# EAGLE schematic ArmazCape - Rev B4 (EAGLE 7.7.0)
Assembly variants: ECO

## Sheet 1 of 4
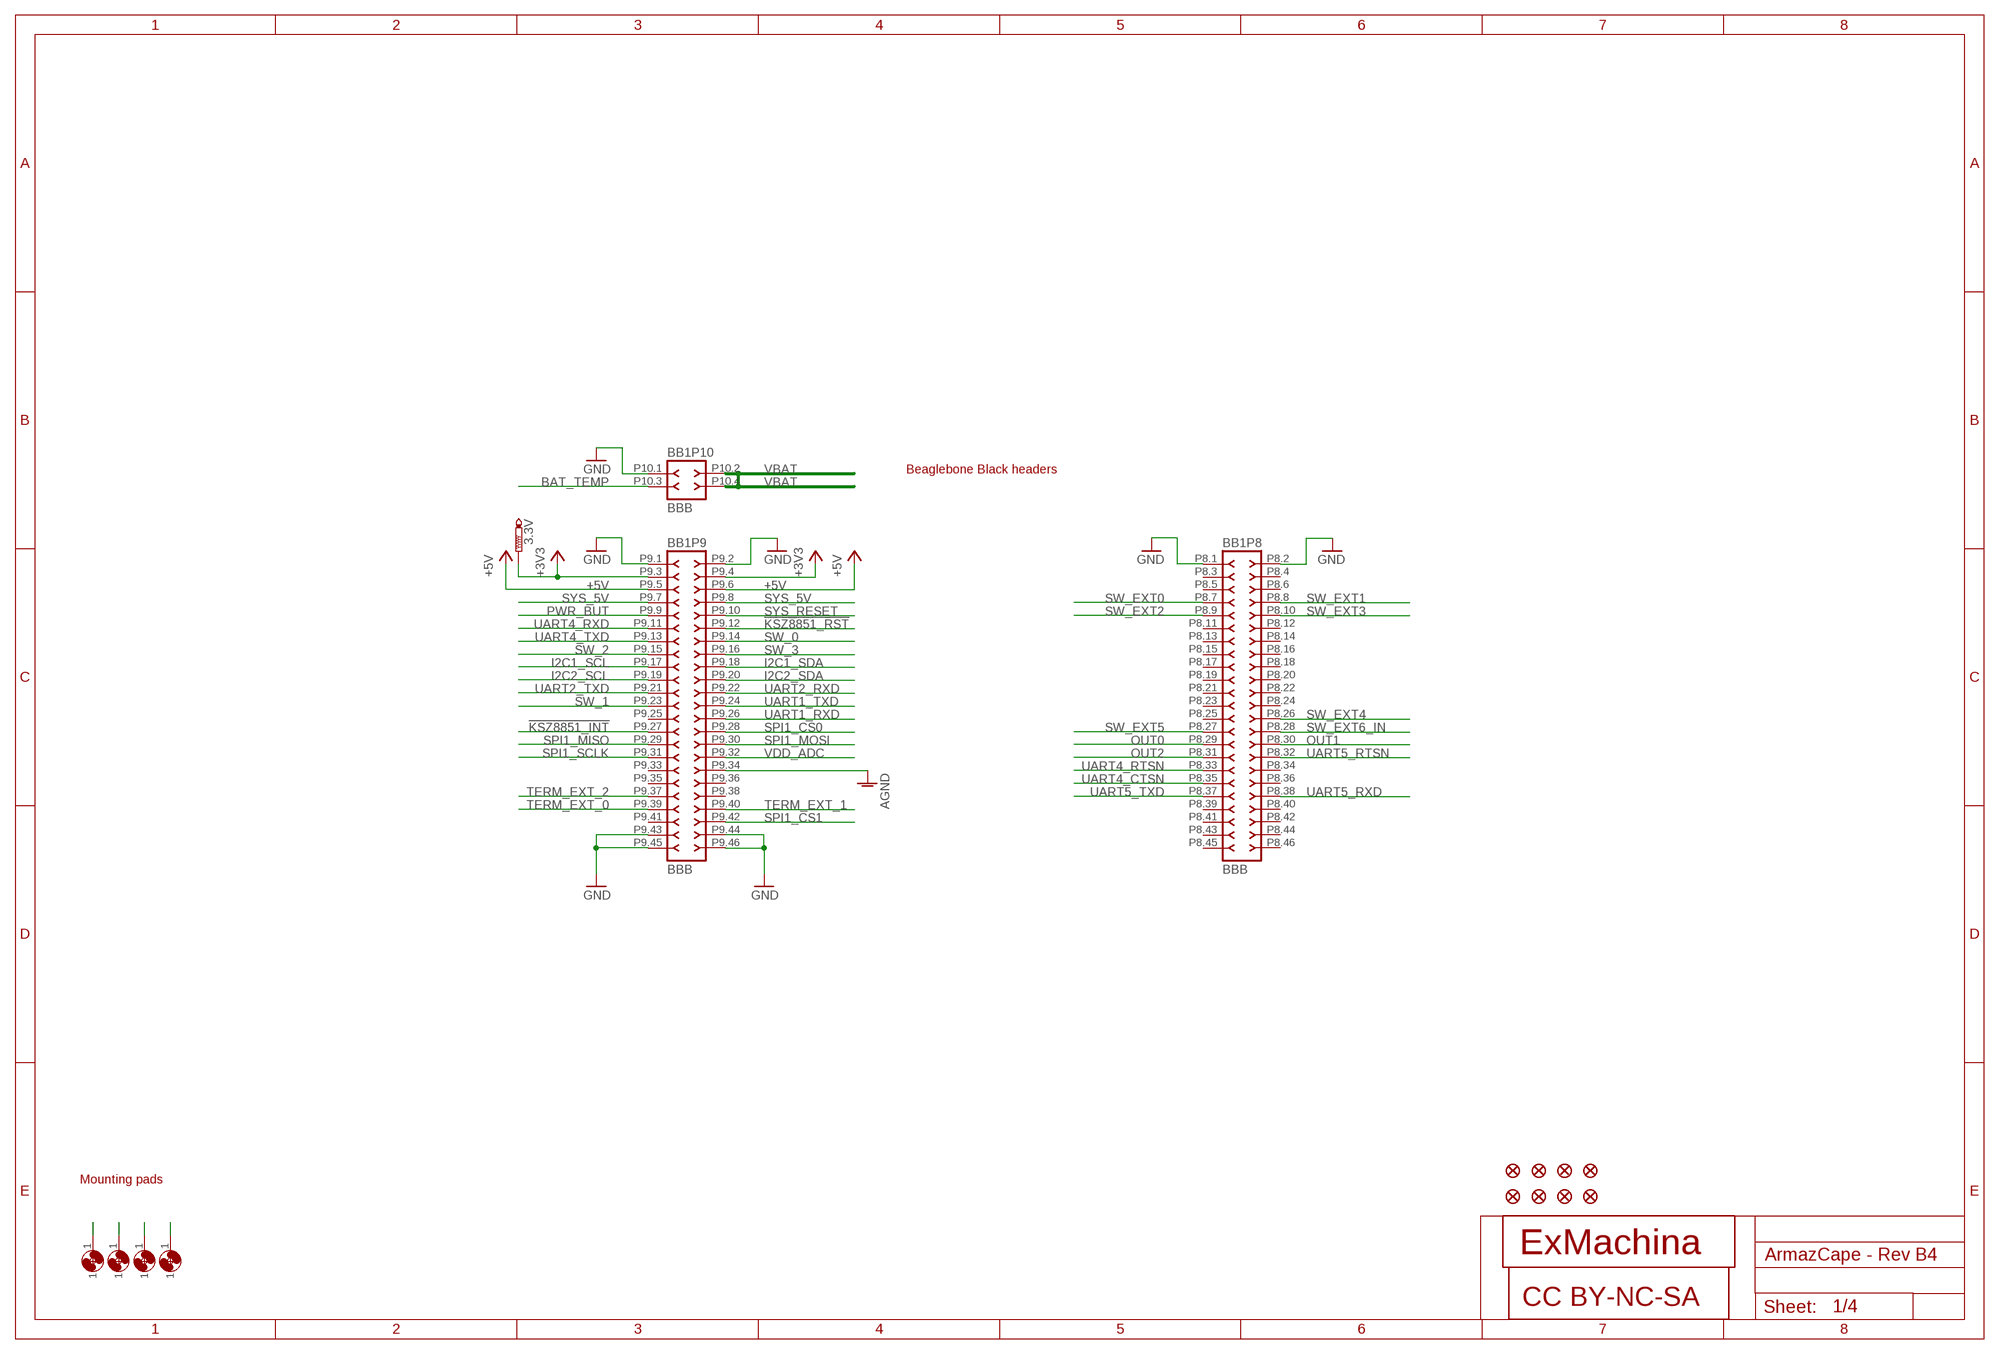
[diagram p0: schematic, sheet 1]

### Parts
3.3V  PTR1TP11R  [TP11R]
BB1  BBB  [BBB]
FI1  FIDUCIAL1X2  [FIDUCIAL-1X2]
FI2  FIDUCIAL1X2  [FIDUCIAL-1X2]
FI3  FIDUCIAL1X2  [FIDUCIAL-1X2]
FI4  FIDUCIAL1X2  [FIDUCIAL-1X2]
FI5  FIDUCIAL1X2  [FIDUCIAL-1X2]
FI6  FIDUCIAL1X2  [FIDUCIAL-1X2]
FI7  FIDUCIAL1X2  [FIDUCIAL-1X2]
FI8  FIDUCIAL1X2  [FIDUCIAL-1X2]
H1  MOUNT-PAD3,0  [P3,0]
H2  MOUNT-PAD3,0  [P3,0]
H3  MOUNT-PAD3,0  [P3,0]
H4  MOUNT-PAD3,0  [P3,0]
U$1  EXMACHINA-LOGO-NAME  [EXM-LOGO-BASELINE]
U$7  CC-BY-NC-SA  [CC-BY-NC-SA]

### Nets
!KSZ8851_INT: BB1.P9.27 ; also sheet 4
!KSZ8851_RST: BB1.P9.12 ; also sheet 4
+3V3 [supply]: 3.3V.TP BB1.P9.3 BB1.P9.4 ; also sheet 2,3,4
+5V [supply]: BB1.P9.5 BB1.P9.6 ; also sheet 2,3
AGND: BB1.P9.34
BAT_TEMP: BB1.P10.3 ; also sheet 3
GND [supply]: BB1.P8.1 BB1.P8.2 BB1.P9.1 BB1.P9.2 BB1.P9.43 BB1.P9.44 BB1.P9.45 BB1.P9.46 BB1.P10.1 ; also sheet 2,3,4
I2C1_SCL: BB1.P9.17
I2C1_SDA: BB1.P9.18
I2C2_SCL: BB1.P9.19 ; also sheet 2,3
I2C2_SDA: BB1.P9.20 ; also sheet 2,3
N$101 [supply]: H4.1
N$102 [supply]: H3.1
N$103 [supply]: H2.1
N$104 [supply]: H1.1
OUT0: BB1.P8.29 ; also sheet 3
OUT1: BB1.P8.30 ; also sheet 3
OUT2: BB1.P8.31 ; also sheet 3
PWR_BUT: BB1.P9.9
SPI1_CS0: BB1.P9.28 ; also sheet 4
SPI1_CS1: BB1.P9.42
SPI1_MISO: BB1.P9.29 ; also sheet 4
SPI1_MOSI: BB1.P9.30 ; also sheet 4
SPI1_SCLK: BB1.P9.31 ; also sheet 4
SW_0: BB1.P9.14 ; also sheet 3
SW_1: BB1.P9.23 ; also sheet 3
SW_2: BB1.P9.15 ; also sheet 3
SW_3: BB1.P9.16 ; also sheet 3
SW_EXT0: BB1.P8.7 ; also sheet 3
SW_EXT1: BB1.P8.8 ; also sheet 3
SW_EXT2: BB1.P8.9 ; also sheet 3
SW_EXT3: BB1.P8.10 ; also sheet 3
SW_EXT4: BB1.P8.26 ; also sheet 3
SW_EXT5: BB1.P8.27 ; also sheet 3
SW_EXT6_IN: BB1.P8.28 ; also sheet 3
SYS_5V [supply]: BB1.P9.7 BB1.P9.8 ; also sheet 3
SYS_RESET: BB1.P9.10
TERM_EXT_0: BB1.P9.39 ; also sheet 2
TERM_EXT_1: BB1.P9.40 ; also sheet 2
TERM_EXT_2: BB1.P9.37 ; also sheet 2
UART1_RXD: BB1.P9.26
UART1_TXD: BB1.P9.24
UART2_RXD: BB1.P9.22
UART2_TXD: BB1.P9.21
UART4_CTSN: BB1.P8.35
UART4_RTSN: BB1.P8.33
UART4_RXD: BB1.P9.11 ; also sheet 3
UART4_TXD: BB1.P9.13 ; also sheet 3
UART5_RTSN: BB1.P8.32
UART5_RXD: BB1.P8.38 ; also sheet 3
UART5_TXD: BB1.P8.37 ; also sheet 3
VBAT [supply]: BB1.P10.2 BB1.P10.4 ; also sheet 3
VDD_ADC: BB1.P9.32 ; also sheet 2
Unconnected: BB1.P8.3 BB1.P8.4 BB1.P8.5 BB1.P8.6 BB1.P8.11 BB1.P8.12 BB1.P8.13 BB1.P8.14 BB1.P8.15 BB1.P8.16 BB1.P8.17 BB1.P8.18 BB1.P8.19 BB1.P8.20 BB1.P8.21 BB1.P8.22 BB1.P8.23 BB1.P8.24 BB1.P8.25 BB1.P8.34 BB1.P8.36 BB1.P8.39 BB1.P8.40 BB1.P8.41 BB1.P8.42 BB1.P8.43 BB1.P8.44 BB1.P8.45 BB1.P8.46 BB1.P9.25 BB1.P9.33 BB1.P9.35 BB1.P9.36 BB1.P9.38 BB1.P9.41

### Notes on the sheet
- Beaglebone Black headers
- Mounting pads

## Sheet 2 of 4
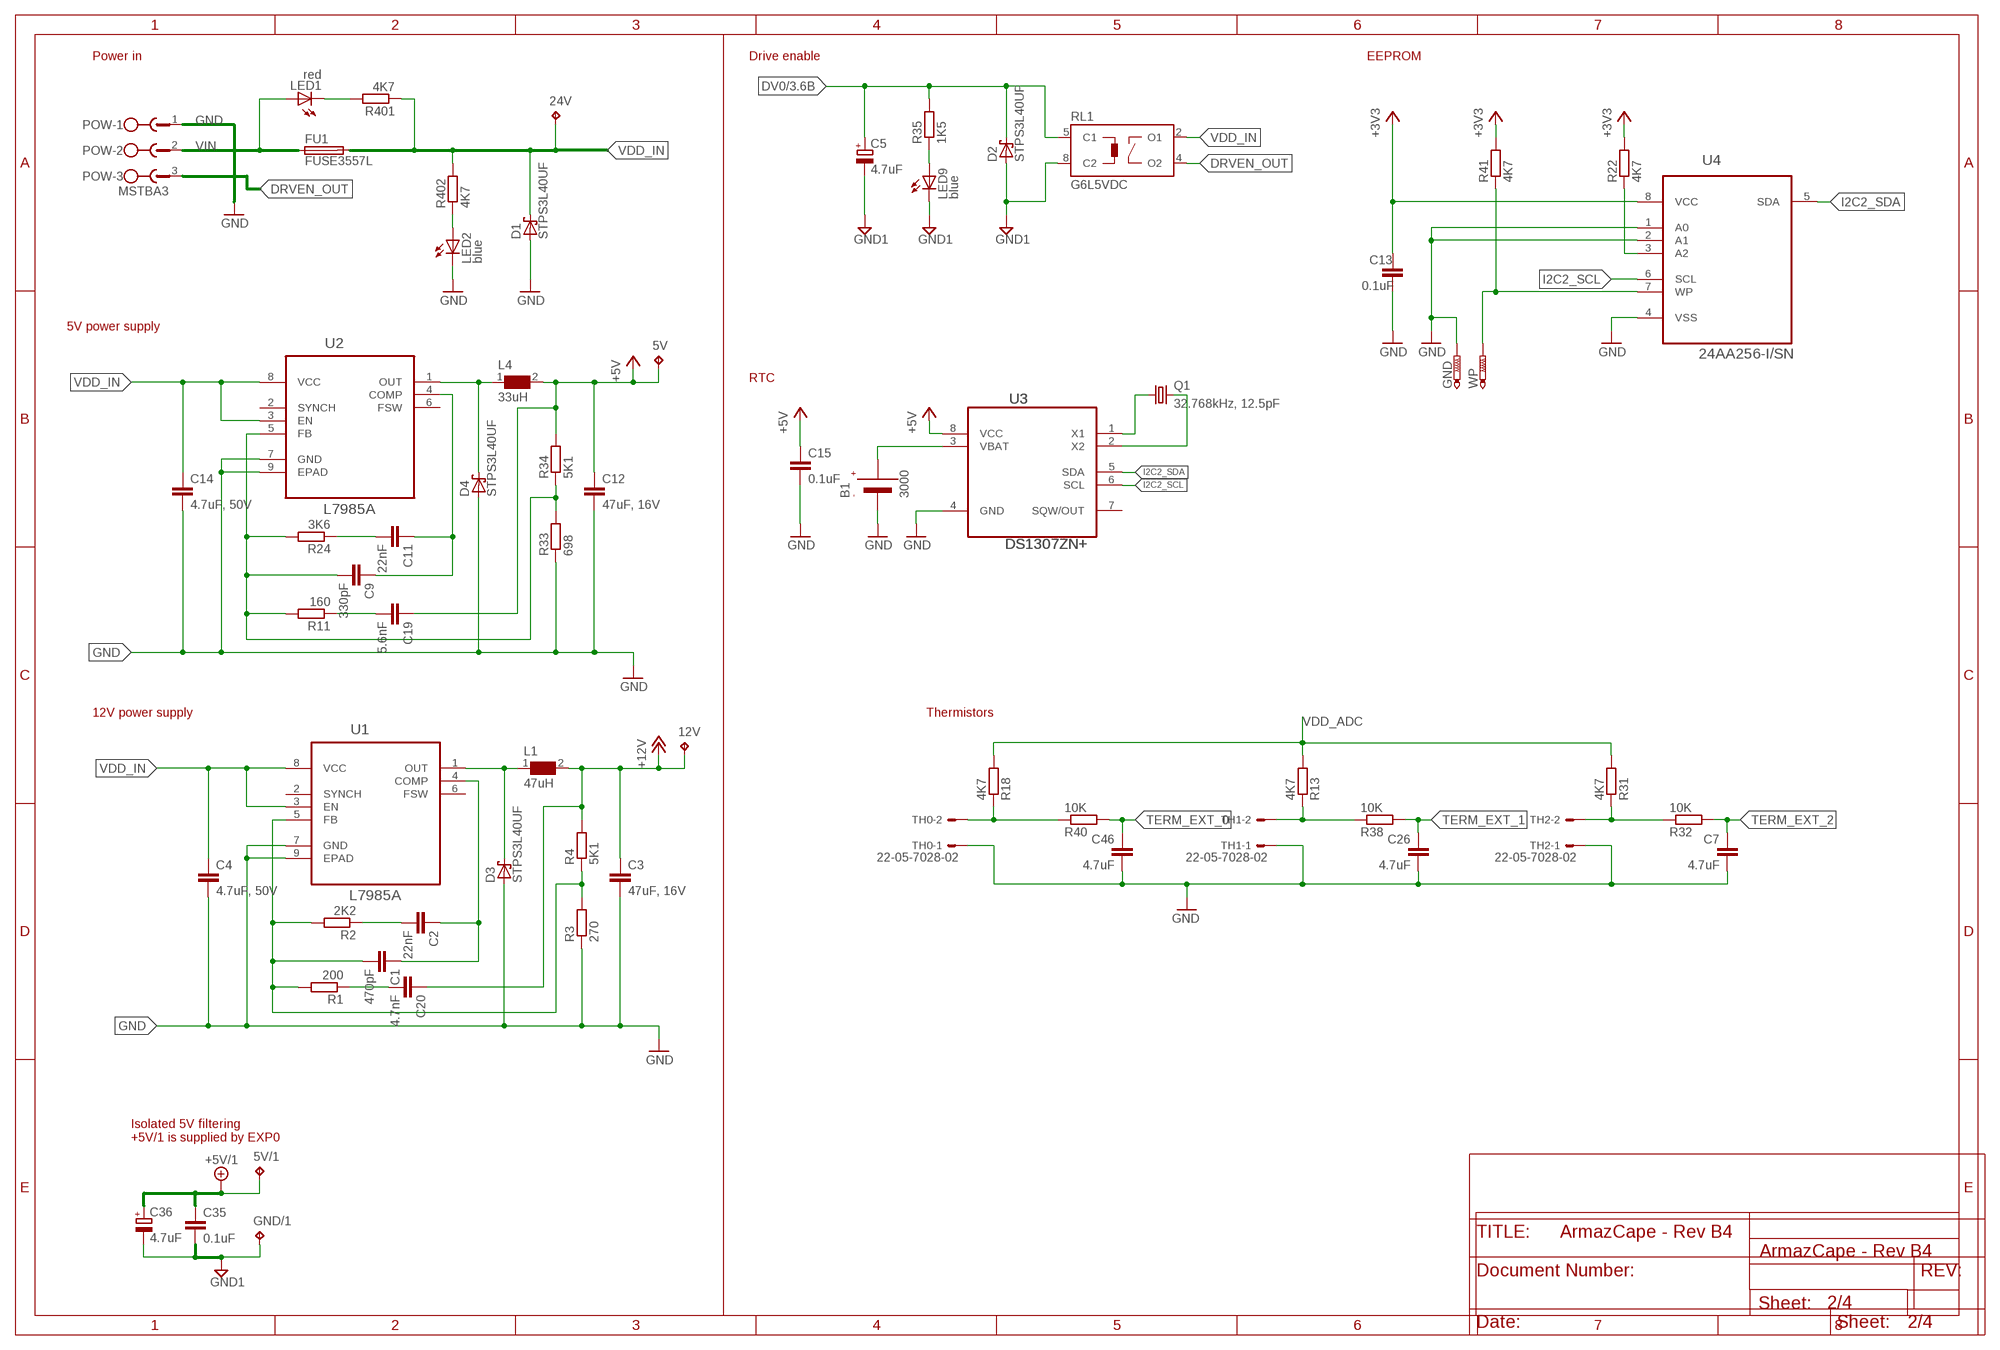
[diagram p1: schematic, sheet 2]

### Parts
5V  TPB1,27  [B1,27]
5V/1  TPB1,27  [B1,27]
12V  TPB1,27  [B1,27]
24V  TPB1,27  [B1,27]
B1  3000  [3000]
C1  470pF  C-EUC0603  [C0603]
C2  22nF  C-EUC0603  [C0603]
C3  47uF, 16V  C-EUC1210  [C1210]
C4  4.7uF, 50V  C-EUC1210  [C1210]
C5  4.7uF  CPOL-EUCT3216  [CT3216]
C7  4.7uF  C-EUC0603  [C0603]
C9  330pF  C-EUC0603  [C0603]
C11  22nF  C-EUC0603  [C0603]
C12  47uF, 16V  C-EUC1210  [C1210]
C13  0.1uF  C-EUC0603  [C0603]
C14  4.7uF, 50V  C-EUC1210  [C1210]
C15  0.1uF  C-EUC0603  [C0603]
C19  5.6nF  C-EUC0603  [C0603]
C20  4.7nF  C-EUC0603  [C0603]
C26  4.7uF  C-EUC0603  [C0603]
C35  0.1uF  C-EUC0603  [C0603]
C36  4.7uF  CPOL-EUCT3216  [CT3216]
C46  4.7uF  C-EUC0603  [C0603]
D1  STPS3L40UF  [SMB]
D2  STPS3L40UF  [SMB]
D3  STPS3L40UF  [SMB]
D4  STPS3L40UF  [SMB]
FU1  FUSE3557L  [3557-LITTLE]
GND  PTR1TP11SQ  [TP11SQ]
GND/1  TPB1,27  [B1,27]
L1  47uH  WE-PD-7447709470_1260/1245/1280/1210  [WE-PD_1260/1245/1280/1210]
L4  33uH  WE-PD-7447709330_1260/1245/1280/1210  [WE-PD_1260/1245/1280/1210]
LED1  red  LEDCHIP-LED0603  [CHIP-LED0603]
LED2  blue  LEDCHIP-LED0603  [CHIP-LED0603]
LED9  blue  LEDCHIP-LED0603  [CHIP-LED0603]  (not fitted in variant ECO)
POW  MSTBA3  [MSTBA3]
Q1  32.768kHz, 12.5pF  ABS07-32.768KHZ  [ABS07]
R1  200  R-EU_R0603  [R0603]
R2  2K2  R-EU_R0603  [R0603]
R3  270  R-EU_R0603  [R0603]
R4  5K1  R-EU_R0603  [R0603]
R11  160  R-EU_R0603  [R0603]
R13  4K7  R-EU_R0603  [R0603]
R18  4K7  R-EU_R0603  [R0603]
R22  4K7  R-EU_R0603  [R0603]
R24  3K6  R-EU_R0603  [R0603]
R31  4K7  R-EU_R0603  [R0603]
R32  10K  R-EU_R0603  [R0603]
R33  698  R-EU_R0603  [R0603]
R34  5K1  R-EU_R0603  [R0603]
R35  1K5  R-EU_R0603  [R0603]
R38  10K  R-EU_R0603  [R0603]
R40  10K  R-EU_R0603  [R0603]
R41  4K7  R-EU_R0603  [R0603]
R401  4K7  R-EU_R0603  [R0603]
R402  4K7  R-EU_R0603  [R0603]
RL1  G6L5VDC  [G6L-1F]
TH0  22-05-7028-02  [7395-02]
TH1  22-05-7028-02  [7395-02]
TH2  22-05-7028-02  [7395-02]
U1  L7985A  [SOIC127P600X170-9N]
U2  L7985A  [SOIC127P600X170-9N]
U3  DS1307ZN+  MAXIM_DS1307ZN+  [MAXIM_SOIC127P600X175-8N]
U4  24AA256-I/SN  MICROCHIP_BY_ELEMENT14_BATCH_1_24AA256-I/SN  [MICROCHIP_BY_ELEMENT14_BATCH_1_SOIC127P600X175-8N]
WP  PTR1TP11R  [TP11R]

### Nets
+3V3 [supply]: C13.1 R22.2 R41.2 U4.8(VCC) ; also sheet 1,3,4
+5V [supply]: 5V.TP C12.1 C15.1 C19.1 L4.2 R34.2 U3.8(VCC) ; also sheet 1,3
+5V/1 [supply]: 5V/1.TP C35.1 C36.+ ; also sheet 3
+12V [supply]: 12V.TP C3.1 C20.1 L1.2 R4.2 ; also sheet 3
DRVEN_OUT [supply]: POW.3 RL1.4(O2)
DV0: C5.+ D2.C R35.2 RL1.5(C1) ; also sheet 3
GND [supply]: B1.-(VBAT-) C3.2 C4.2 C7.2 C12.2 C13.2 C14.2 C15.2 C26.2 C46.2 D1.A D3.A D4.A GND.TP LED2.C POW.1 R3.1 R33.1 TH0.1 TH1.1 TH2.1 U1.7(GND) U1.9(EPAD) U2.7(GND) U2.9(EPAD) U3.4(GND) U4.1(A0) U4.2(A1) U4.4(VSS) ; also sheet 1,3,4
GND1 [supply]: C5.- C35.2 C36.- D2.A GND/1.TP LED9.C RL1.8(C2) ; also sheet 3
I2C2_SCL: U3.6(SCL) U4.6(SCL) ; also sheet 1,3
I2C2_SDA: U3.5(SDA) U4.5(SDA) ; also sheet 1,3
N$1 [supply]: C1.2 R1.2 R2.2 R3.2 R4.1 U1.5(FB)
N$2: C2.2 R2.1
N$3: C1.1 C2.1 U1.4(COMP)
N$7: LED9.A R35.1
N$8: LED1.C R401.2
N$19 [supply]: D4.C L4.1 U2.1(OUT)
N$21 [supply]: C9.2 R11.2 R24.2 R33.2 R34.1 U2.5(FB)
N$24: Q1.1 U3.1(X1)
N$25: R31.1 R32.1 TH2.2
N$26: Q1.2 U3.2(X2)
N$28: C11.2 R24.1
N$29: C9.1 C11.1 U2.4(COMP)
N$30 [supply]: D3.C L1.1 U1.1(OUT)
N$32: C19.2 R11.1
N$33: C20.2 R1.1
N$34: R41.1 U4.7(WP) WP.TP
N$35: R22.1 U4.3(A2)
N$96: LED2.A R402.1
N$237: R13.1 R38.1 TH1.2
N$240: R18.1 R40.1 TH0.2
TERM_EXT_0: C46.1 R40.2 ; also sheet 1
TERM_EXT_1: C26.1 R38.2 ; also sheet 1
TERM_EXT_2: C7.1 R32.2 ; also sheet 1
VBAT+ [supply]: B1.+1(VBAT+) B1.+2(VBAT+) U3.3(VBAT)
VDD_ADC: R13.2 R18.2 R31.2 ; also sheet 1
VDD_IN [supply]: 24V.TP C4.1 C14.1 D1.C FU1.3 FU1.4 R401.1 R402.2 RL1.2(O1) U1.3(EN) U1.8(VCC) U2.3(EN) U2.8(VCC)
VIN [supply]: FU1.1 FU1.2 LED1.A POW.2
Unconnected: U1.2(SYNCH) U1.6(FSW) U2.2(SYNCH) U2.6(FSW) U3.7(SQW/OUT)

### Notes on the sheet
- Power in | Drive enable | EEPROM
- 5V power supply
- RTC
- 12V power supply | Thermistors
- Isolated 5V filtering
  +5V/1 is supplied by EXP0

## Sheet 3 of 4
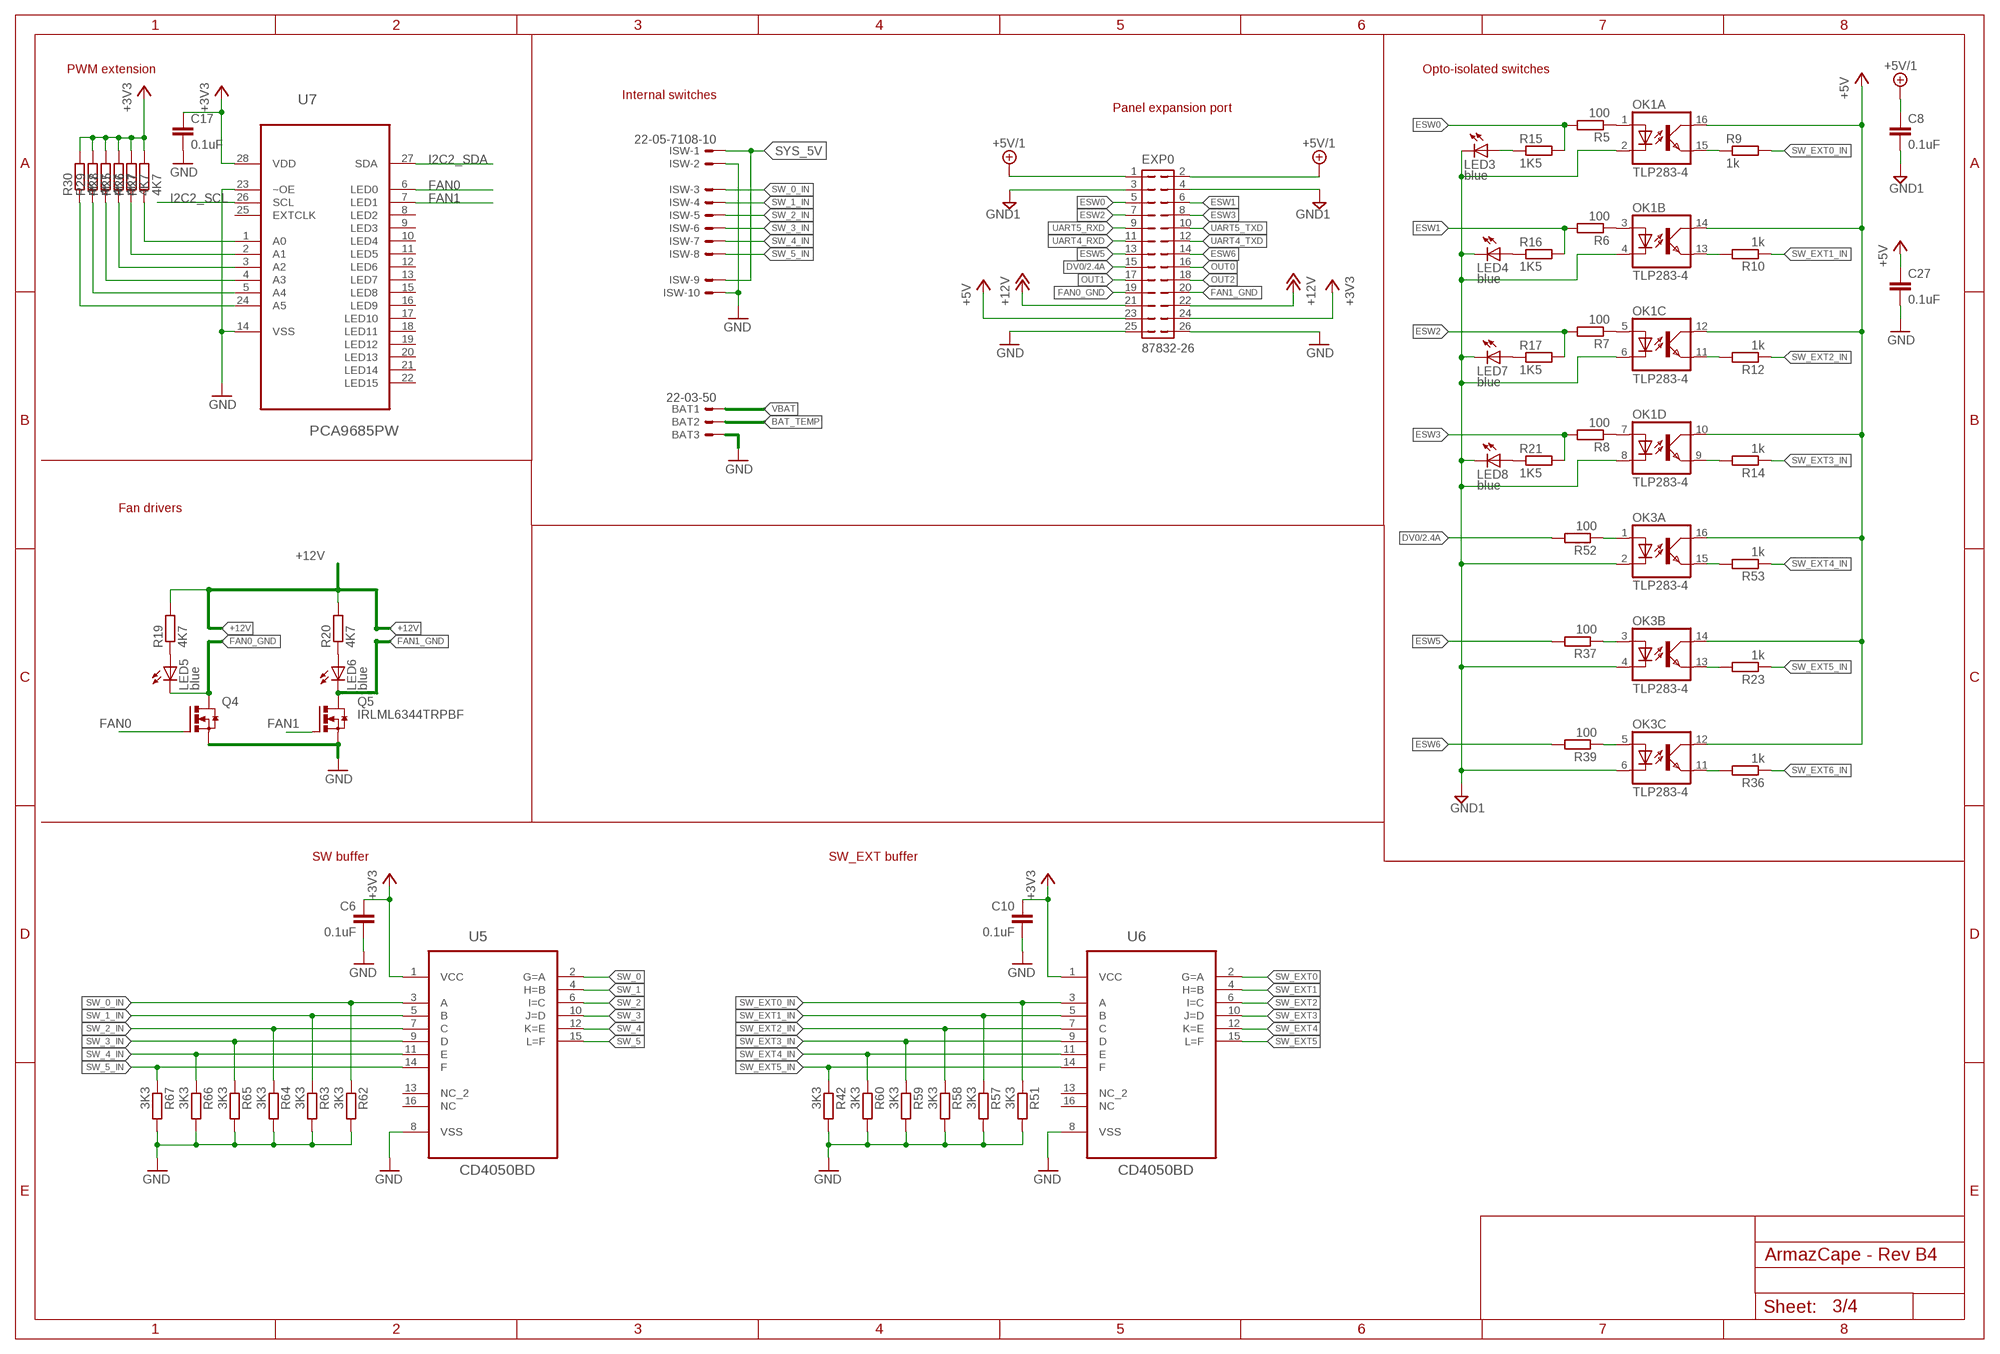
[diagram p2: schematic, sheet 3]

### Parts
BAT  22-03-50  [5267-03A]
C6  0.1uF  C-EUC0603  [C0603]
C8  0.1uF  C-EUC0603  [C0603]
C10  0.1uF  C-EUC0603  [C0603]
C17  0.1uF  C-EUC0603  [C0603]
C27  0.1uF  C-EUC0603  [C0603]
EXP0  87832-26  [87832-26]
ISW  22-05-7108-10  [7395-10]
LED3  blue  LEDCHIP-LED0603  [CHIP-LED0603]  (not fitted in variant ECO)
LED4  blue  LEDCHIP-LED0603  [CHIP-LED0603]  (not fitted in variant ECO)
LED5  blue  LEDCHIP-LED0603  [CHIP-LED0603]  (not fitted in variant ECO)
LED6  blue  LEDCHIP-LED0603  [CHIP-LED0603]  (not fitted in variant ECO)
LED7  blue  LEDCHIP-LED0603  [CHIP-LED0603]  (not fitted in variant ECO)
LED8  blue  LEDCHIP-LED0603  [CHIP-LED0603]  (not fitted in variant ECO)
OK1  TLP283-4  [MINI-FLAT-16]
OK3  TLP283-4  [MINI-FLAT-16]
Q4  IRLML6344TRPBF  [SOT95P240X112-3N]
Q5  IRLML6344TRPBF  [SOT95P240X112-3N]
R5  100  R-EU_R0603  [R0603]
R6  100  R-EU_R0603  [R0603]
R7  100  R-EU_R0603  [R0603]
R8  100  R-EU_R0603  [R0603]
R9  1k  R-EUR0603  [R0603]
R10  1k  R-EUR0603  [R0603]
R12  1k  R-EUR0603  [R0603]
R14  1k  R-EUR0603  [R0603]
R15  1K5  R-EU_R0603  [R0603]
R16  1K5  R-EU_R0603  [R0603]
R17  1K5  R-EU_R0603  [R0603]
R19  4K7  R-EU_R0603  [R0603]
R20  4K7  R-EU_R0603  [R0603]
R21  1K5  R-EU_R0603  [R0603]
R23  1k  R-EUR0603  [R0603]
R25  4K7  R-EU_R0603  [R0603]
R26  4K7  R-EU_R0603  [R0603]
R27  4K7  R-EU_R0603  [R0603]
R28  4K7  R-EU_R0603  [R0603]
R29  4K7  R-EU_R0603  [R0603]
R30  4K7  R-EU_R0603  [R0603]
R36  1k  R-EUR0603  [R0603]
R37  100  R-EU_R0603  [R0603]
R39  100  R-EU_R0603  [R0603]
R42  3K3  R-EU_R0603  [R0603]
R51  3K3  R-EU_R0603  [R0603]
R52  100  R-EU_R0603  [R0603]
R53  1k  R-EUR0603  [R0603]
R57  3K3  R-EU_R0603  [R0603]
R58  3K3  R-EU_R0603  [R0603]
R59  3K3  R-EU_R0603  [R0603]
R60  3K3  R-EU_R0603  [R0603]
R62  3K3  R-EU_R0603  [R0603]
R63  3K3  R-EU_R0603  [R0603]
R64  3K3  R-EU_R0603  [R0603]
R65  3K3  R-EU_R0603  [R0603]
R66  3K3  R-EU_R0603  [R0603]
R67  3K3  R-EU_R0603  [R0603]
U5  CD4050BD  [SOIC127P600X175-16N]
U6  CD4050BD  [SOIC127P600X175-16N]
U7  PCA9685PW  [SOP65P640X110-28N]

### Nets
+3V3 [supply]: C6.1 C10.1 C17.1 EXP0.24 R25.2 R26.2 R27.2 R28.2 R29.2 R30.2 U5.1(VCC) U6.1(VCC) U7.28(VDD) ; also sheet 1,2,4
+5V [supply]: C27.1 EXP0.23 OK1.10(D:COL) OK1.12(C:COL) OK1.14(B:COL) OK1.16(A:COL) OK3.12(C:COL) OK3.14(B:COL) OK3.16(A:COL) ; also sheet 1,2
+5V/1 [supply]: C8.1 EXP0.1 EXP0.2 ; also sheet 2
+12V [supply]: EXP0.21 EXP0.22 R19.2 R20.2 ; also sheet 2
BAT_TEMP: BAT.P2 ; also sheet 1
DV0: EXP0.15 R52.2 ; also sheet 2
ESW0: EXP0.5 R5.2 R15.2
ESW1: EXP0.6 R6.2 R16.2
ESW2: EXP0.7 R7.2 R17.2
ESW3: EXP0.8 R8.2 R21.2
ESW5: EXP0.13 R37.2
ESW6: EXP0.14 R39.2
FAN0: Q4.1(G) U7.6(LED0)
FAN0_GND [supply]: EXP0.19 LED5.C Q4.3(D)
FAN1: Q5.1(G) U7.7(LED1)
FAN1_GND [supply]: EXP0.20 LED6.C Q5.3(D)
GND [supply]: BAT.P3 C6.2 C10.2 C17.2 C27.2 EXP0.25 EXP0.26 ISW.2 ISW.10 Q4.2(S) Q5.2(S) R42.2 R51.2 R57.2 R58.2 R59.2 R60.2 R62.2 R63.2 R64.2 R65.2 R66.2 R67.2 U5.8(VSS) U6.8(VSS) U7.14(VSS) U7.23(~OE) ; also sheet 1,2,4
GND1 [supply]: C8.2 EXP0.3 EXP0.4 LED3.C LED4.C LED7.C LED8.C OK1.2(A:C) OK1.4(B:C) OK1.6(C:C) OK1.8(D:C) OK3.2(A:C) OK3.4(B:C) OK3.6(C:C) ; also sheet 2
I2C2_SCL: U7.26(SCL) ; also sheet 1,2
I2C2_SDA: U7.27(SDA) ; also sheet 1,2
N$4: OK3.11(C:EMIT) R36.2
N$5: OK3.13(B:EMIT) R23.2
N$6: OK3.3(B:A) R37.1
N$9: LED5.A R19.1
N$10: OK1.1(A:A) R5.1
N$11: OK1.15(A:EMIT) R9.1
N$12: OK1.7(D:A) R8.1
N$13: OK1.9(D:EMIT) R14.2
N$14: OK1.11(C:EMIT) R12.2
N$15: OK1.13(B:EMIT) R10.2
N$16: LED3.A R15.1
N$17: OK1.3(B:A) R6.1
N$18: LED4.A R16.1
N$20: LED7.A R17.1
N$22: LED8.A R21.1
N$23: OK1.5(C:A) R7.1
N$27: OK3.5(C:A) R39.1
N$53: OK3.1(A:A) R52.1
N$54: OK3.15(A:EMIT) R53.2
N$58: R27.1 U7.1(A0)
N$59: R26.1 U7.2(A1)
N$76: R25.1 U7.3(A2)
N$94: R28.1 U7.4(A3)
N$95: R29.1 U7.5(A4)
N$112: R30.1 U7.24(A5)
N$117: LED6.A R20.1
OUT0: EXP0.16 ; also sheet 1
OUT1: EXP0.17 ; also sheet 1
OUT2: EXP0.18 ; also sheet 1
SW_0: U5.2(G=A) ; also sheet 1
SW_0_IN: ISW.3 R62.1 U5.3(A)
SW_1: U5.4(H=B) ; also sheet 1
SW_1_IN: ISW.4 R63.1 U5.5(B)
SW_2: U5.6(I=C) ; also sheet 1
SW_2_IN: ISW.5 R64.1 U5.7(C)
SW_3: U5.10(J=D) ; also sheet 1
SW_3_IN: ISW.6 R65.1 U5.9(D)
SW_4: U5.12(K=E)
SW_4_IN: ISW.7 R66.1 U5.11(E)
SW_5: U5.15(L=F)
SW_5_IN: ISW.8 R67.1 U5.14(F)
SW_EXT0: U6.2(G=A) ; also sheet 1
SW_EXT0_IN: R9.2 R51.1 U6.3(A)
SW_EXT1: U6.4(H=B) ; also sheet 1
SW_EXT1_IN: R10.1 R57.1 U6.5(B)
SW_EXT2: U6.6(I=C) ; also sheet 1
SW_EXT2_IN: R12.1 R58.1 U6.7(C)
SW_EXT3: U6.10(J=D) ; also sheet 1
SW_EXT3_IN: R14.1 R59.1 U6.9(D)
SW_EXT4: U6.12(K=E) ; also sheet 1
SW_EXT4_IN: R53.1 R60.1 U6.11(E)
SW_EXT5: U6.15(L=F) ; also sheet 1
SW_EXT5_IN: R23.1 R42.1 U6.14(F)
SW_EXT6_IN: R36.1 ; also sheet 1
SYS_5V [supply]: ISW.1 ISW.9 ; also sheet 1
UART4_RXD: EXP0.11 ; also sheet 1
UART4_TXD: EXP0.12 ; also sheet 1
UART5_RXD: EXP0.9 ; also sheet 1
UART5_TXD: EXP0.10 ; also sheet 1
VBAT [supply]: BAT.P1 ; also sheet 1
Unconnected: OK3.7(D:A) OK3.8(D:C) OK3.9(D:EMIT) OK3.10(D:COL) U5.13(NC_2) U5.16(NC) U6.13(NC_2) U6.16(NC) U7.8(LED2) U7.9(LED3) U7.10(LED4) U7.11(LED5) U7.12(LED6) U7.13(LED7) U7.15(LED8) U7.16(LED9) U7.17(LED10) U7.18(LED11) U7.19(LED12) U7.20(LED13) U7.21(LED14) U7.22(LED15) U7.25(EXTCLK)

### Notes on the sheet
- PWM extension | Opto-isolated switches
- Internal switches
- Panel expansion port
- Fan drivers
- SW buffer | SW_EXT buffer

## Sheet 4 of 4
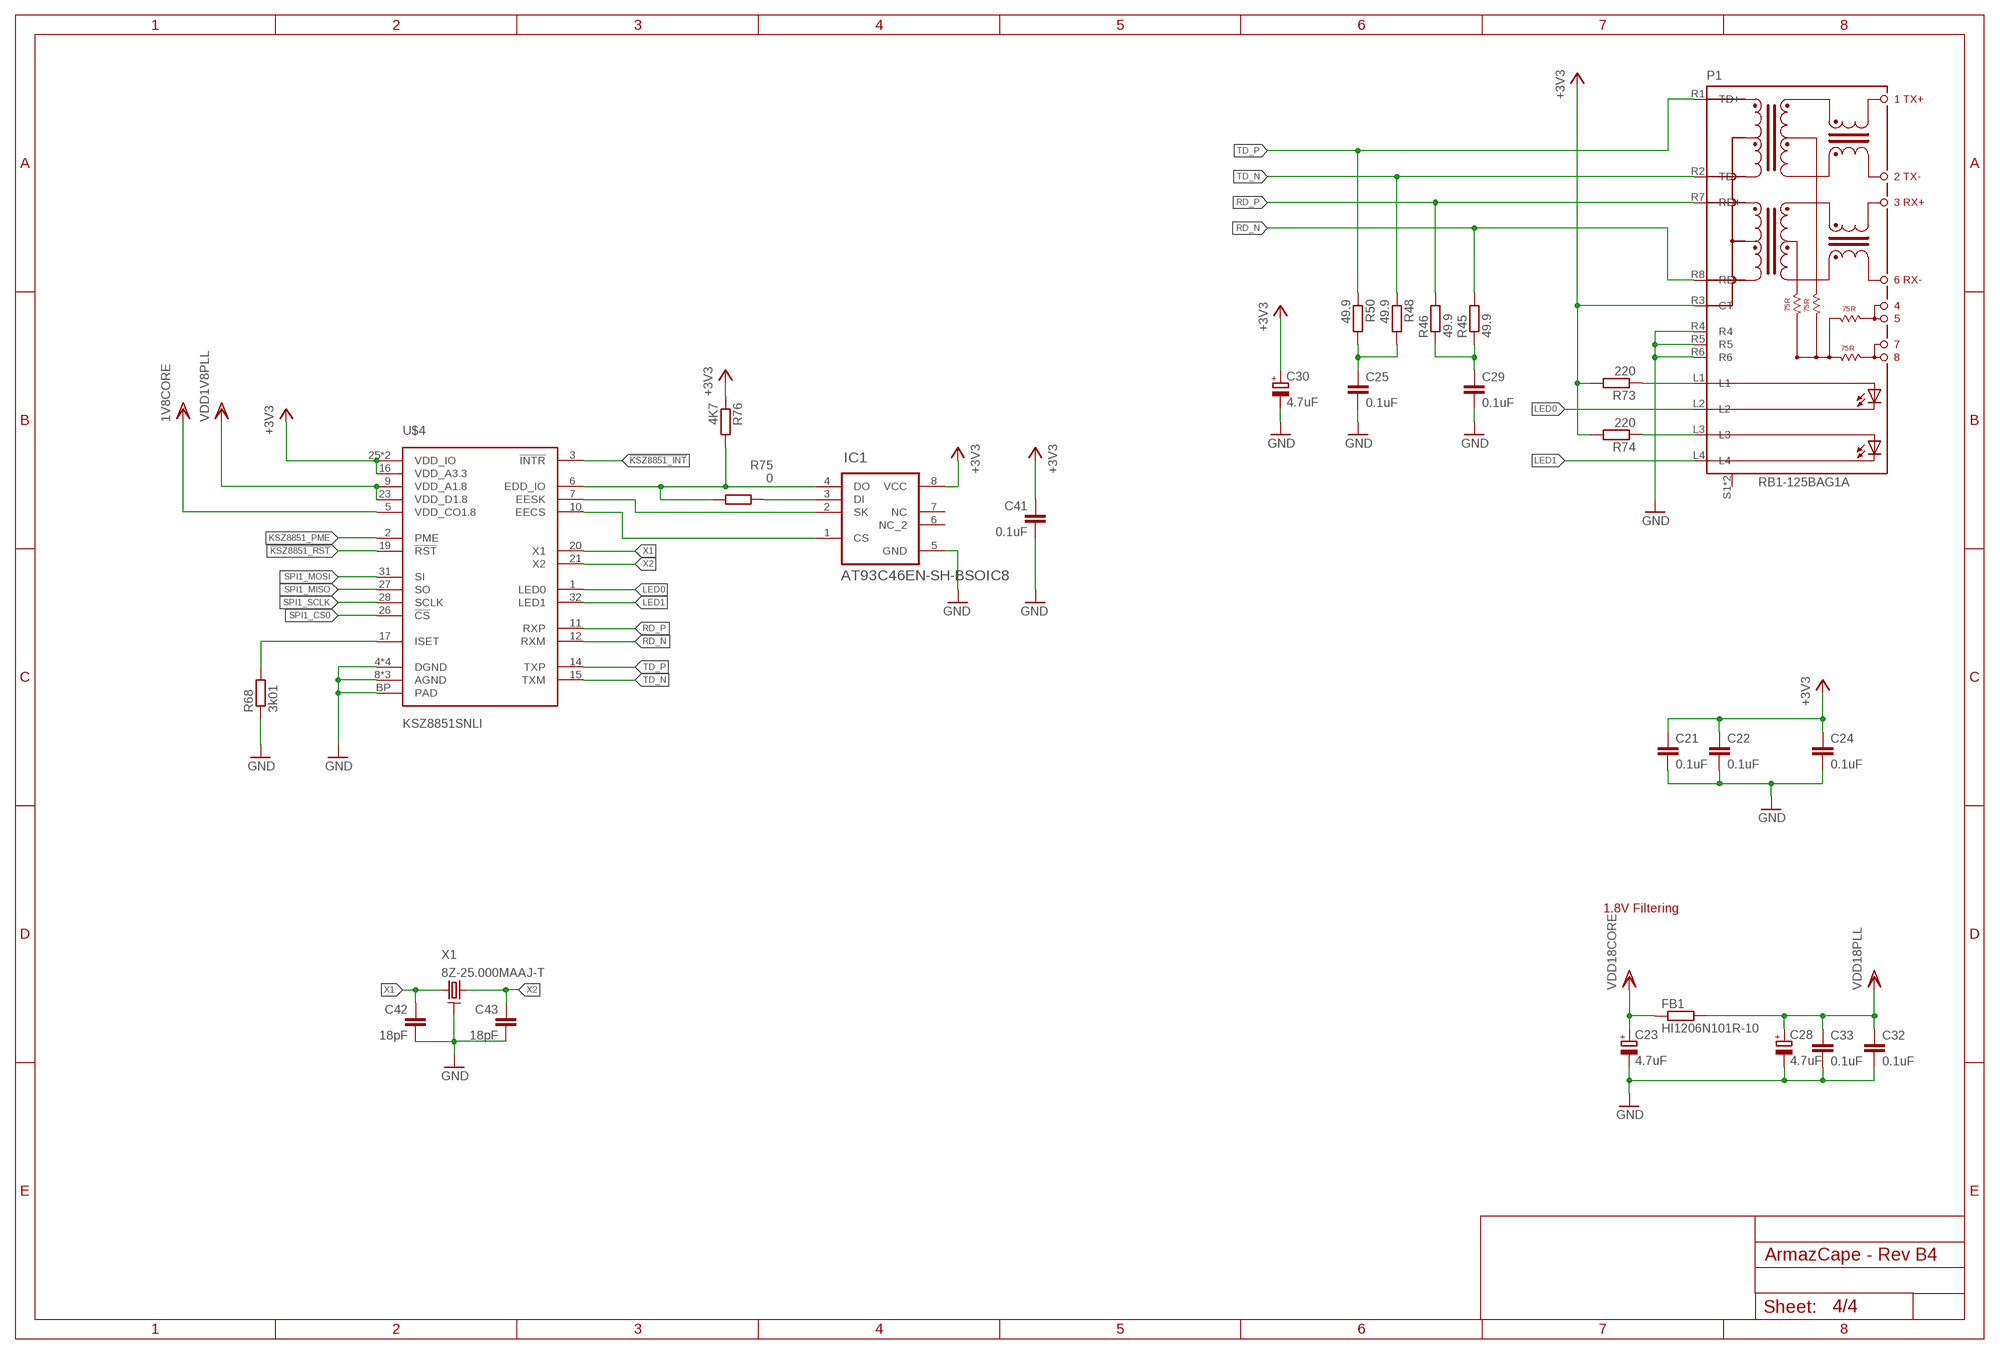
[diagram p3: schematic, sheet 4]

### Parts
C21  0.1uF  C-EUC0603  [C0603]
C22  0.1uF  C-EUC0603  [C0603]
C23  4.7uF  CPOL-EUCT3216  [CT3216]
C24  0.1uF  C-EUC0603  [C0603]
C25  0.1uF  C-EUC0603  [C0603]
C28  4.7uF  CPOL-EUCT3216  [CT3216]
C29  0.1uF  C-EUC0603  [C0603]
C30  4.7uF  CPOL-EUCT3216  [CT3216]
C32  0.1uF  C-EUC0603  [C0603]
C33  0.1uF  C-EUC0603  [C0603]
C41  0.1uF  C-EUC0603  [C0603]
C42  18pF  C-EUC0603  [C0603]
C43  18pF  C-EUC0603  [C0603]
FB1  HI1206N101R-10  [1206]
IC1  AT93C46EN-SH-BSOIC8  [SOIC8]
P1  RB1-125BAG1A  [WIZNET_RB1-125BAG1A]
R45  49.9  R-EU_R0603  [R0603]
R46  49.9  R-EU_R0603  [R0603]
R48  49.9  R-EU_R0603  [R0603]
R50  49.9  R-EU_R0603  [R0603]
R68  3k01  R-EU_R0603  [R0603]
R73  220  R-EU_R0603  [R0603]
R74  220  R-EU_R0603  [R0603]
R75  0  R-EU_R0603  [R0603]
R76  4K7  R-EU_R0603  [R0603]
U$4  KSZ8851SNLI  [QFN50P500X500X85-32L]
X1  8Z-25.000MAAJ-T  8Z-25.000MHZMAAJ-T  [SMD2.5X2]

### Nets
!KSZ8851_INT: U$4.3(!INTR) ; also sheet 1
!KSZ8851_RST: U$4.19(!RST) ; also sheet 1
+3V3 [supply]: C21.1 C22.1 C24.1 C30.+ C41.1 IC1.8(VCC) P1.R3(CT) R73.2 R74.2 R76.1 U$4.16(VDD_A3.3) U$4.25(VDD_IO) U$4.30(VDD_IO) ; also sheet 1,2,3
EDDIO: IC1.4(DO) R75.2 R76.2 U$4.6(EDD_IO)
EECS: IC1.1(CS) U$4.10(EECS)
EESK: IC1.2(SK) U$4.7(EESK)
GND [supply]: C21.2 C22.2 C23.- C24.2 C25.2 C28.- C29.2 C30.- C32.2 C33.2 C41.2 C42.2 C43.2 IC1.5(GND) P1.R4 P1.R5 P1.R6 R68.1 U$4.4(DGND) U$4.8(AGND) U$4.13(AGND) U$4.18(AGND) U$4.22(DGND) U$4.24(DGND) U$4.29(DGND) U$4.BP(PAD) X1.2 X1.4 ; also sheet 1,2,3
KSZ8851_PME: U$4.2(PME)
LED0: P1.L2 U$4.1(LED0)
LED1: P1.L4 U$4.32(LED1)
N$43: C25.1 R48.2 R50.2
N$49: C29.1 R45.1 R46.1
N$50: R68.2 U$4.17(ISET)
N$56: P1.L1 R73.1
N$60: P1.L3 R74.1
N$64: IC1.3(DI) R75.1
RD_N: P1.R8(RD-) R45.2 U$4.12(RXM)
RD_P: P1.R7(RD+) R46.2 U$4.11(RXP)
SPI1_CS0: U$4.26(!CS) ; also sheet 1
SPI1_MISO: U$4.27(SO) ; also sheet 1
SPI1_MOSI: U$4.31(SI) ; also sheet 1
SPI1_SCLK: U$4.28(SCLK) ; also sheet 1
TD_N: P1.R2(TD-) R48.1 U$4.15(TXM)
TD_P: P1.R1(TD+) R50.1 U$4.14(TXP)
VDD18CORE: C23.+ FB1.1 U$4.5(VDD_CO1.8) ; supply symbol labelled 1V8CORE
VDD18PLL: C28.+ C32.1 C33.1 FB1.2 U$4.9(VDD_A1.8) U$4.23(VDD_D1.8) ; supply symbol labelled VDD1V8PLL
X1: C42.1 U$4.20(X1) X1.1
X2: C43.1 U$4.21(X2) X1.3
Unconnected: IC1.6(NC_2) IC1.7(NC) P1.S1 P1.S2

### Notes on the sheet
- 1.8V Filtering

## Library data of the parts
3.3V GND WP = testpad:PTR1: TEST PIN; OC_FARNELL: unknown; OC_NEWARK: unknown
5V 5V/1 12V 24V GND/1 = testpad:TP: Test pad; OC_FARNELL: unknown; OC_NEWARK: unknown
B1 = keystone:3000; MF: KEYSTONE ELECTR; MPN: 3000; OC_FARNELL: 1650692; OC_NEWARK: 66F5622
BAT = con-molex:22-?-50; MPN: 22-03-5035; OC_FARNELL: 9979620; OC_NEWARK: 98K6552
BB1 = beaglebone:BBB; OC_FARNELL: unknown; OC_NEWARK: unknown
C1 = rcl:C-EU: CAPACITOR, European symbol; MPN: GRM1885C1H471JA01D; OC_FARNELL: 2494241; OC_NEWARK: 03AC2702
C2 C11 = rcl:C-EU: CAPACITOR, European symbol; MF: FARNELL; MPN: GRM188R71H223KA01D; OC_FARNELL: 1828896; OC_NEWARK: 38K1672
C3 C12 = rcl:C-EU: CAPACITOR, European symbol; MPN: GRM32ER61C476KE15K; OC_FARNELL: 1735538; OC_NEWARK: 96Y9294
C4 C14 = rcl:C-EU: CAPACITOR, European symbol; MPN: GCM32ER71H475KA55L; OC_FARNELL: 1828841; OC_NEWARK: 12AC6489
C5 C23 C28 C30 C36 = rcl:CPOL-EU: POLARIZED CAPACITOR, European symbol; MF: KEMET; MPN: T491A475K010AT; OC_FARNELL: 1818579; OC_NEWARK: 57K1703
C6 C8 C10 C13 C15 C17 C21 C22 C24 C25 C27 C29 C32 C33 C35 C41 = rcl:C-EU: CAPACITOR, European symbol; MPN: GRM188R71H104KA93D; OC_FARNELL: 1759037; OC_NEWARK: 19X1715
C7 C26 C46 = rcl:C-EU: CAPACITOR, European symbol; MPN: GRM188R60J475KE19D; OC_FARNELL: 2320811; OC_NEWARK: 03AC2654
C9 = rcl:C-EU: CAPACITOR, European symbol; MF: FARNELL; MPN: GRM1885C1H331JA01D; OC_FARNELL: 1759075; OC_NEWARK: 38K1687
C19 = rcl:C-EU: CAPACITOR, European symbol; MPN: C0603C562J5GACTU; OC_FARNELL: 1759099; OC_NEWARK: 79M0848
C20 = rcl:C-EU: CAPACITOR, European symbol; MF: FARNELL; MPN: GRM188R71H472KA01D; OC_FARNELL: 8819971; OC_NEWARK: 38K1673
C42 C43 = rcl:C-EU: CAPACITOR, European symbol; MPN: MC0603N180J500CT; OC_FARNELL: 1759006; OC_NEWARK: 06R5138
D1-D4 = diode:STPS3L40?; MP: STMICROELECTRONICS; MPN: STPS3L40UF; OC_FARNELL: 2341599; OC_NEWARK: 06X0873
EXP0 = con-molex:87832-26: Milli-Grid Header 2.00mm (.079") Pitch; MF: MOLEX; MPN: 87832-2620; OC_FARNELL: 2313712; OC_NEWARK: 59J1830
FB1 = emi_filter:HI?N101R-10; MC: LAIRD TECHNOLOGIES; MPN: HI1206N101R-10; OC_FARNELL: 2292367; OC_NEWARK: 66W8861
FI1-FI8 = SparkFun:FIDUCIAL: Fiducial Alignment Points Various fiducial points for machine vision alignment.; OC_FARNELL: unknown; OC_NEWARK: unknown
FU1 = fuse2:FUSE: Fuse; MPN: 3557; OC_FARNELL: 2292902; OC_NEWARK: 22M2711
H1-H4 = holes:MOUNT-PAD: MOUNTING HOLE with drill center marker; OC_FARNELL: unknown; OC_NEWARK: unknown
IC1 = atmel:AT93C46EN-SH-B: Three-wire Serial EEPROM,SOIC-8; MPN: AT93C46EN-SH-T; OC_FARNELL: 2345627; OC_NEWARK: 68T5247
ISW = con-molex:22-?-10: CONNECTOR wire to board 2.54 mm (.1 inch) pitch header; MPN: 22-05-7108; OC_FARNELL: 9731660; OC_NEWARK: 26M6365
L1 = WE-PD:WE-PD: SMD-Shielded Power Inductors WE-PD - Magnetically shielded version which results in a low leakage field - High storage capacity - Low self-losses - Highest possible current loading for SMD-Inducors -- Switching regulators with low operating voltages (computer, laptop, mobile phones, pagers) -- Integrated DC/DC-converter -- Is recommended for the application with switching regulators from National Semiconductor, Linear Technology, Texas Instruments and Fairchild Semiconductor, ect. -- Graphic cards -- Plastic base: Because of the one piece construction these are more suitable for high vibration or shock applications; MPN: 7447709470; OC_FARNELL: 1635946; OC_NEWARK: 08P2777; PACKAGE: 1210; SUPPLIER: Wuerth Elektronik
L4 = WE-PD:WE-PD: SMD-Shielded Power Inductors WE-PD - Magnetically shielded version which results in a low leakage field - High storage capacity - Low self-losses - Highest possible current loading for SMD-Inducors -- Switching regulators with low operating voltages (computer, laptop, mobile phones, pagers) -- Integrated DC/DC-converter -- Is recommended for the application with switching regulators from National Semiconductor, Linear Technology, Texas Instruments and Fairchild Semiconductor, ect. -- Graphic cards -- Plastic base: Because of the one piece construction these are more suitable for high vibration or shock applications; MPN: 7447709330; OC_FARNELL: 2082654; OC_NEWARK: 88T7077; PACKAGE: 1210; SUPPLIER: Wuerth Elektronik
LED1 = led:LED: LED OSRAM: - CHIPLED LG R971, LG N971, LY N971, LG Q971, LY Q971, LO R971, LY R971 LH N974, LH R974 LS Q976, LO Q976, LY Q976 LO Q996 - Hyper CHIPLED LW Q18S LB Q993, LB Q99A, LB R99A - SideLED LS A670, LO A670, LY A670, LG A670, LP A670 LB A673, LV A673, LT A673, LW A673 LH A674 LY A675 LS A676, LA A676, LO A676, LY A676, LW A676 LS A679, LY A679, LG A679 - Hyper Micro SIDELED® LS Y876, LA Y876, LO Y876, LY Y876 LT Y87S - SmartLED LW L88C, LW L88S LB L89C, LB L89S, LG L890 LS L89K, LO L89K, LY L89K LS L896, LA L896, LO L896, LY L896 - TOPLED LS T670, LO T670, LY T670, LG T670, LP T670 LSG T670, LSP T670, LSY T670, LOP T670, LYG T670 LG T671, LOG T671, LSG T671 LB T673, LV T673, LT T673, LW T673 LH T674 LS T676, LA T676, LO T676, LY T676, LB T676, LH T676, LSB T676, LW T676 LB T67C, LV T67C, LT T67C, LS T67K, LO T67K, LY T67K, LW E67C LS E67B, LA E67B, LO E67B, LY E67B, LB E67C, LV E67C, LT E67C LW T67C LS T679, LY T679, LG T679 LS T770, LO T770, LY T770, LG T770, LP T770 LB T773, LV T773, LT T773, LW T773 LH T774 LS E675, LA E675, LY E675, LS T675 LS T776, LA T776, LO T776, LY T776, LB T776 LHGB T686 LT T68C, LB T68C - Hyper Mini TOPLED® LB M676 - Mini TOPLED Santana® LG M470 LS M47K, LO M47K, LY M47K Source: http://www.osram.convergy.de LUXEON: - LUMILED® LXK2-PW12-R00, LXK2-PW12-S00, LXK2-PW14-U00, LXK2-PW14-V00 LXK2-PM12-R00, LXK2-PM12-S00, LXK2-PM14-U00 LXK2-PE12-Q00, LXK2-PE12-R00, LXK2-PE12-S00, LXK2-PE14-T00, LXK2-PE14-U00 LXK2-PB12-K00, LXK2-PB12-L00, LXK2-PB12-M00, LXK2-PB14-N00, LXK2-PB14-P00, LXK2-PB14-Q00 LXK2-PR12-L00, LXK2-PR12-M00, LXK2-PR14-Q00, LXK2-PR14-R00 LXK2-PD12-Q00, LXK2-PD12-R00, LXK2-PD12-S00 LXK2-PH12-R00, LXK2-PH12-S00 LXK2-PL12-P00, LXK2-PL12-Q00, LXK2-PL12-R00 Source: www.luxeon.com KINGBRIGHT: KA-3528ASYC Source: www.kingbright.com; MPN: OVS-0608; OC_FARNELL: 1716774; OC_NEWARK: 15R2208
LED2-LED9 = led:LED: LED OSRAM: - CHIPLED LG R971, LG N971, LY N971, LG Q971, LY Q971, LO R971, LY R971 LH N974, LH R974 LS Q976, LO Q976, LY Q976 LO Q996 - Hyper CHIPLED LW Q18S LB Q993, LB Q99A, LB R99A - SideLED LS A670, LO A670, LY A670, LG A670, LP A670 LB A673, LV A673, LT A673, LW A673 LH A674 LY A675 LS A676, LA A676, LO A676, LY A676, LW A676 LS A679, LY A679, LG A679 - Hyper Micro SIDELED® LS Y876, LA Y876, LO Y876, LY Y876 LT Y87S - SmartLED LW L88C, LW L88S LB L89C, LB L89S, LG L890 LS L89K, LO L89K, LY L89K LS L896, LA L896, LO L896, LY L896 - TOPLED LS T670, LO T670, LY T670, LG T670, LP T670 LSG T670, LSP T670, LSY T670, LOP T670, LYG T670 LG T671, LOG T671, LSG T671 LB T673, LV T673, LT T673, LW T673 LH T674 LS T676, LA T676, LO T676, LY T676, LB T676, LH T676, LSB T676, LW T676 LB T67C, LV T67C, LT T67C, LS T67K, LO T67K, LY T67K, LW E67C LS E67B, LA E67B, LO E67B, LY E67B, LB E67C, LV E67C, LT E67C LW T67C LS T679, LY T679, LG T679 LS T770, LO T770, LY T770, LG T770, LP T770 LB T773, LV T773, LT T773, LW T773 LH T774 LS E675, LA E675, LY E675, LS T675 LS T776, LA T776, LO T776, LY T776, LB T776 LHGB T686 LT T68C, LB T68C - Hyper Mini TOPLED® LB M676 - Mini TOPLED Santana® LG M470 LS M47K, LO M47K, LY M47K Source: http://www.osram.convergy.de LUXEON: - LUMILED® LXK2-PW12-R00, LXK2-PW12-S00, LXK2-PW14-U00, LXK2-PW14-V00 LXK2-PM12-R00, LXK2-PM12-S00, LXK2-PM14-U00 LXK2-PE12-Q00, LXK2-PE12-R00, LXK2-PE12-S00, LXK2-PE14-T00, LXK2-PE14-U00 LXK2-PB12-K00, LXK2-PB12-L00, LXK2-PB12-M00, LXK2-PB14-N00, LXK2-PB14-P00, LXK2-PB14-Q00 LXK2-PR12-L00, LXK2-PR12-M00, LXK2-PR14-Q00, LXK2-PR14-R00 LXK2-PD12-Q00, LXK2-PD12-R00, LXK2-PD12-S00 LXK2-PH12-R00, LXK2-PH12-S00 LXK2-PL12-P00, LXK2-PL12-Q00, LXK2-PL12-R00 Source: www.luxeon.com KINGBRIGHT: KA-3528ASYC Source: www.kingbright.com; MPN: OVS-0603; OC_FARNELL: 1716770; OC_NEWARK: 15R2205
OK1 OK3 = optocoupler:TLP283-4: TOSHIBA PHOTOCOUPLER GaAs IRED & PHOTO-TRANSISTOR Source: http://www.semicon.toshiba.co.jp/td/en/Opto/Photocoupler/en_20050928_TLP283_datasheet.pdf; MF: VISHAY/TELEFUNKEN; MPN: TCMT4100; OC_FARNELL: 1779650; OC_NEWARK: 06H1639
P1 = con-wiznet:RB1-125BAG1A: Accessory RJ-45 With Transformer Connector - UDE; OC_FARNELL: unknown; OC_NEWARK: unknown
POW = con-phoenix-508:MSTBA3: PHOENIX; MF: FARNELL; MPN: 1757255; OC_FARNELL: 3705183; OC_NEWARK: 71C4162
Q1 = crystal:ABS07-?; MPN: ABS06-32.768KHZ-T; OC_FARNELL: 2101347; OC_NEWARK: 52R7999
Q4 Q5 = International_Rectifier_By_element14_Batch_1:IRLML6344TRPBF: Power MOSFET; MPN: IRLML6344TRPBF; OC_FARNELL: 1857299; OC_NEWARK: 25T5501; PACKAGE: SOT-23-3; SUPPLIER: INTERNATIONAL RECTIFIER
R1 = rcl:R-EU_: RESISTOR, European symbol; MPN: RC0603FR-07200RL; OC_FARNELL: 2073417; OC_NEWARK: 68R0071
R2 = rcl:R-EU_: RESISTOR, European symbol; MPN: RC0603FR-072K2L; OC_FARNELL: 2073429; OC_NEWARK: 68R0064
R3 = rcl:R-EU_: RESISTOR, European symbol; MPN: RC0603FR-07270RL; OC_FARNELL: 2073451; OC_NEWARK: 98K7385
R4 R34 = rcl:R-EU_: RESISTOR, European symbol; MPN: RC0603FR-075K1L; OC_FARNELL: 2073522; OC_NEWARK: 68R0101
R5-R8 R37 R39 R52 = rcl:R-EU_: RESISTOR, European symbol; MPN: RC0603FR-07100RL; OC_FARNELL: 2073347; OC_NEWARK: 68R0052
R9 R10 R12 R14 R23 R36 R53 = rcl-2:R-EU: RESISTOR, European symbol; MPN: RC0603FR-071KL; OC_FARNELL: 2073348; OC_NEWARK: 68R0042
R11 = rcl:R-EU_: RESISTOR, European symbol; MPN: RC0603FR-07160RL; OC_FARNELL: 2447260; OC_NEWARK: 66R2081
R13 R18-R20 R22 R25-R31 R41 R76 R401 R402 = rcl:R-EU_: RESISTOR, European symbol; MPN: RC0603FR-074K7L; OC_FARNELL: 2073509; OC_NEWARK: 68R0092
R15-R17 R21 R35 = rcl:R-EU_: RESISTOR, European symbol; MPN: RC0603FR-071K5L; OC_FARNELL: 2073391; OC_NEWARK: 68R0045
R24 = rcl:R-EU_: RESISTOR, European symbol; MPN: RC0603FR-073K6L; OC_FARNELL: 2073482; OC_NEWARK: 68R0080
R32 R38 R40 = rcl:R-EU_: RESISTOR, European symbol; MPN: RC0603FR-0710KL; OC_FARNELL: 2073349; OC_NEWARK: 68R0049
R33 = rcl:R-EU_: RESISTOR, European symbol; MPN: RC0603FR-07698RL; OC_FARNELL: 1170773; OC_NEWARK: 66R2546
R42 R51 R57-R60 R62-R67 = rcl:R-EU_: RESISTOR, European symbol; MPN: RC0603FR-073K3L; OC_FARNELL: 9331026; OC_NEWARK: 68R0079
R45 R46 R48 R50 = rcl:R-EU_: RESISTOR, European symbol; MPN: RC0603FR-0749R9L; OC_FARNELL: 2073520; OC_NEWARK: 68R0100
R68 = rcl:R-EU_: RESISTOR, European symbol; MPN: MC0063W060313K01; OC_FARNELL: 2073461; OC_NEWARK: 94W5780
R73 R74 = rcl:R-EU_: RESISTOR, European symbol; MF: Multicomp Passives; MPN: MC0063W06031220R; OC_FARNELL: 2073428; OC_NEWARK: 58K4526
R75 = rcl:R-EU_: RESISTOR, European symbol; MF: Multicomp Passives; MPN: MC0603WG00000T5E-TC; OC_FARNELL: 2073345; OC_NEWARK: 58K4684
RL1 = rel-omron:G6L; MF: OMRON COMPONENTS USA; MPN: G6L-1F DC5; OC_FARNELL: 2213840; OC_NEWARK: 35K4537
TH0 TH1 TH2 = con-molex:22-?-02: CONNECTOR wire to board 2.54 mm (.1 inch) pitch header; MPN: 22-05-7028; OC_FARNELL: 9731601; OC_NEWARK: 25M1728
U1 U2 = stmicroelectronics:L7985A: BUCK, 4.5-38V, 2A, 1MHZ, 0.6-38V, 8HSOP; OC_FARNELL: 2311340; OC_NEWARK: unknown; PACKAGE: HSOP8; SUPPLIER: STMicroelectronics
U3 = ArmazCape - Rev B2:MAXIM_DS1307ZN+: 64 x 8, Serial, I2C Real-Time Clock; MPN: DS1307N+; OC_FARNELL: 9725253; OC_NEWARK: 73Y1207; PACKAGE: SOIC-8; SUPPLIER: Maxim
U4 = ArmazCape - Rev B2:MICROCHIP_BY_ELEMENT14_BATCH_1_24AA256-I/SN: EEPROM; MPN: 24AA256-I/SN; OC_FARNELL: 1331295; OC_NEWARK: 35M0711; PACKAGE: SOIC-8; SUPPLIER: MICROCHIP
U5 U6 = ti:CD4050BD: CMOS Hex Buffer/Converters; MPN: CD4050BD; OC_FARNELL: 1740857; OC_NEWARK: 50R5062; PACKAGE: 16-SOIC; SUPPLIER: Texas Instruments
U7 = custom:PCA9685PW: 16-channel, 12-bit PWM Fm+ I2C-bus LED controller; MPN: PCA9685PW; OC_FARNELL: 1854074; OC_NEWARK: 19T6398; PACKAGE: TSSOP-28; SUPPLIER: NXP
U$1 = exmachina:EXMACHINA-LOGO; OC_FARNELL: unknown; OC_NEWARK: unknown
U$4 = Micrel_By_element14_Batch_1:KSZ8851SNL; MPN: KSZ8851SNLI-TR; OC_FARNELL: 1961911; OC_NEWARK: 72Y5310
U$7 = cc-by-sa:CC-BY-NC-SA; OC_FARNELL: unknown; OC_NEWARK: unknown
X1 = crystal:8Z; MPN: 8Z-25.000MAAJ-T; OC_FARNELL: 1842189; OC_NEWARK: 84R5794

## Net classes
0 default: width 0.178 mm, drill 0.25 mm, clearance 0.102 mm
1 supply: width 0.406 mm, drill 0.35 mm, clearance 0.203 mm to class 0, clearance 0.02 mm